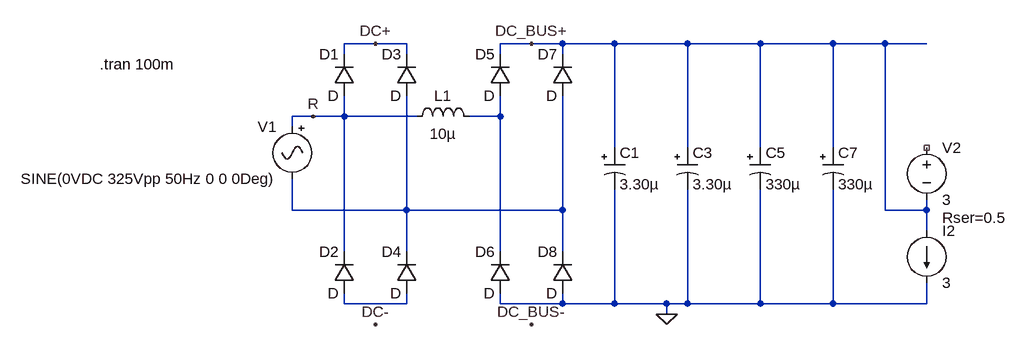
[diagram p0: schematic 2ph AC rectifier (226VAC - 720uF) - Copy.asc]
2ph AC rectifier (226VAC - 720uF) - Copy.asc, the LTspice schematic file:
Version 4
SHEET 1 1296 680
WIRE 80 -96 32 -96
WIRE 128 -96 80 -96
WIRE 320 -96 272 -96
WIRE 368 -96 320 -96
WIRE 448 -96 368 -96
WIRE 560 -96 448 -96
WIRE 672 -96 560 -96
WIRE 784 -96 672 -96
WIRE 864 -96 784 -96
WIRE 928 -96 864 -96
WIRE 32 -80 32 -96
WIRE 128 -80 128 -96
WIRE 272 -80 272 -96
WIRE 368 -80 368 -96
WIRE -16 16 -48 16
WIRE 32 16 32 -16
WIRE 32 16 -16 16
WIRE 144 16 32 16
WIRE 272 16 272 -16
WIRE 272 16 224 16
WIRE -48 32 -48 16
WIRE 448 64 448 -96
WIRE 560 64 560 -96
WIRE 672 64 672 -96
WIRE 784 64 784 -96
WIRE -48 160 -48 112
WIRE 128 160 128 -16
WIRE 128 160 -48 160
WIRE 368 160 368 -16
WIRE 368 160 128 160
WIRE 864 160 864 -96
WIRE 928 160 928 144
WIRE 928 160 864 160
WIRE 928 192 928 160
WIRE 32 224 32 16
WIRE 128 224 128 160
WIRE 272 224 272 16
WIRE 368 224 368 160
WIRE 32 304 32 288
WIRE 128 304 128 288
WIRE 128 304 32 304
WIRE 272 304 272 288
WIRE 368 304 368 288
WIRE 368 304 272 304
WIRE 448 304 448 128
WIRE 448 304 368 304
WIRE 528 304 448 304
WIRE 560 304 560 128
WIRE 560 304 528 304
WIRE 672 304 672 128
WIRE 672 304 560 304
WIRE 784 304 784 128
WIRE 784 304 672 304
WIRE 928 304 928 272
WIRE 928 304 784 304
WIRE 528 320 528 304
FLAG -16 16 R
FLAG 80 336 DC-
FLAG 80 -96 DC+
FLAG 320 336 DC_BUS-
FLAG 528 320 0
FLAG 320 -96 DC_BUS+
SYMBOL Misc\\signal -48 16 M0
WINDOW 123 0 0 Left 2
WINDOW 39 24 132 Left 2
SYMATTR InstName V1
SYMATTR Value SINE(0VDC 325Vpp 50Hz 0 0 0Deg)
SYMBOL diode 48 -16 R180
WINDOW 0 24 64 Left 2
WINDOW 3 24 0 Left 2
SYMATTR InstName D1
SYMBOL diode 48 288 R180
WINDOW 0 24 64 Left 2
WINDOW 3 24 0 Left 2
SYMATTR InstName D2
SYMBOL diode 144 -16 R180
WINDOW 0 24 64 Left 2
WINDOW 3 24 0 Left 2
SYMATTR InstName D3
SYMBOL diode 144 288 R180
WINDOW 0 24 64 Left 2
WINDOW 3 24 0 Left 2
SYMATTR InstName D4
SYMBOL diode 288 -16 R180
WINDOW 0 24 64 Left 2
WINDOW 3 24 0 Left 2
SYMATTR InstName D5
SYMBOL diode 288 288 R180
WINDOW 0 24 64 Left 2
WINDOW 3 24 0 Left 2
SYMATTR InstName D6
SYMBOL diode 384 -16 R180
WINDOW 0 24 64 Left 2
WINDOW 3 24 0 Left 2
SYMATTR InstName D7
SYMBOL diode 384 288 R180
WINDOW 0 24 64 Left 2
WINDOW 3 24 0 Left 2
SYMATTR InstName D8
SYMBOL polcap 432 64 R0
WINDOW 3 24 56 Left 2
SYMATTR Value 3.30µ
SYMATTR InstName C1
SYMATTR Description Capacitor
SYMATTR Type cap
SYMATTR SpiceLine V=400 Irms=2 Rser=0.603 Lser=0
SYMBOL polcap 544 64 R0
WINDOW 3 24 56 Left 2
SYMATTR Value 3.30µ
SYMATTR InstName C3
SYMATTR Description Capacitor
SYMATTR Type cap
SYMATTR SpiceLine V=400 Irms=2 Rser=0.603 Lser=0
SYMBOL polcap 656 64 R0
WINDOW 3 24 56 Left 2
SYMATTR Value 330µ
SYMATTR InstName C5
SYMATTR Description Capacitor
SYMATTR Type cap
SYMATTR SpiceLine V=400 Irms=2 Rser=0.603 Lser=0
SYMBOL polcap 768 64 R0
WINDOW 3 24 56 Left 2
SYMATTR Value 330µ
SYMATTR InstName C7
SYMATTR Description Capacitor
SYMATTR Type cap
SYMATTR SpiceLine V=400 Irms=2 Rser=0.603 Lser=0
SYMBOL current 928 192 R0
WINDOW 123 0 0 Left 2
WINDOW 39 0 0 Left 2
SYMATTR InstName I2
SYMATTR Value 3
SYMBOL voltage 928 48 R0
WINDOW 123 0 0 Left 2
WINDOW 39 24 124 Left 2
SYMATTR SpiceLine Rser=0.5
SYMATTR InstName V2
SYMATTR Value 3
SYMBOL ind 128 32 R270
WINDOW 0 32 56 VTop 2
WINDOW 3 5 56 VBottom 2
SYMATTR InstName L1
SYMATTR Value 10µ
TEXT -344 -64 Left 2 !.tran 100m

The netlist it stands for:
* 2ph AC rectifier (226VAC - 720uF) - Copy.asc
V1 R N002 SINE(0VDC 325Vpp 50Hz 0 0 0Deg)
D1 R DC+ D
D2 N003 R D
D3 N002 DC+ D
D4 N003 N002 D
D5 N001 DC_BUS+ D
D6 0 N001 D
D7 N002 DC_BUS+ D
D8 0 N002 D
C1 DC_BUS+ 0 3.30µ V=400 Irms=2 Rser=0.603 Lser=0
C3 DC_BUS+ 0 3.30µ V=400 Irms=2 Rser=0.603 Lser=0
C5 DC_BUS+ 0 330µ V=400 Irms=2 Rser=0.603 Lser=0
C7 DC_BUS+ 0 330µ V=400 Irms=2 Rser=0.603 Lser=0
I2 DC_BUS+ 0 3
V2 NC_01 DC_BUS+ 3 Rser=0.5
L1 R N001 10µ
.model D D
.lib standard.dio
.tran 100m
.backanno
.end